# Altium schematic sheet RS232.SchDoc
size A3
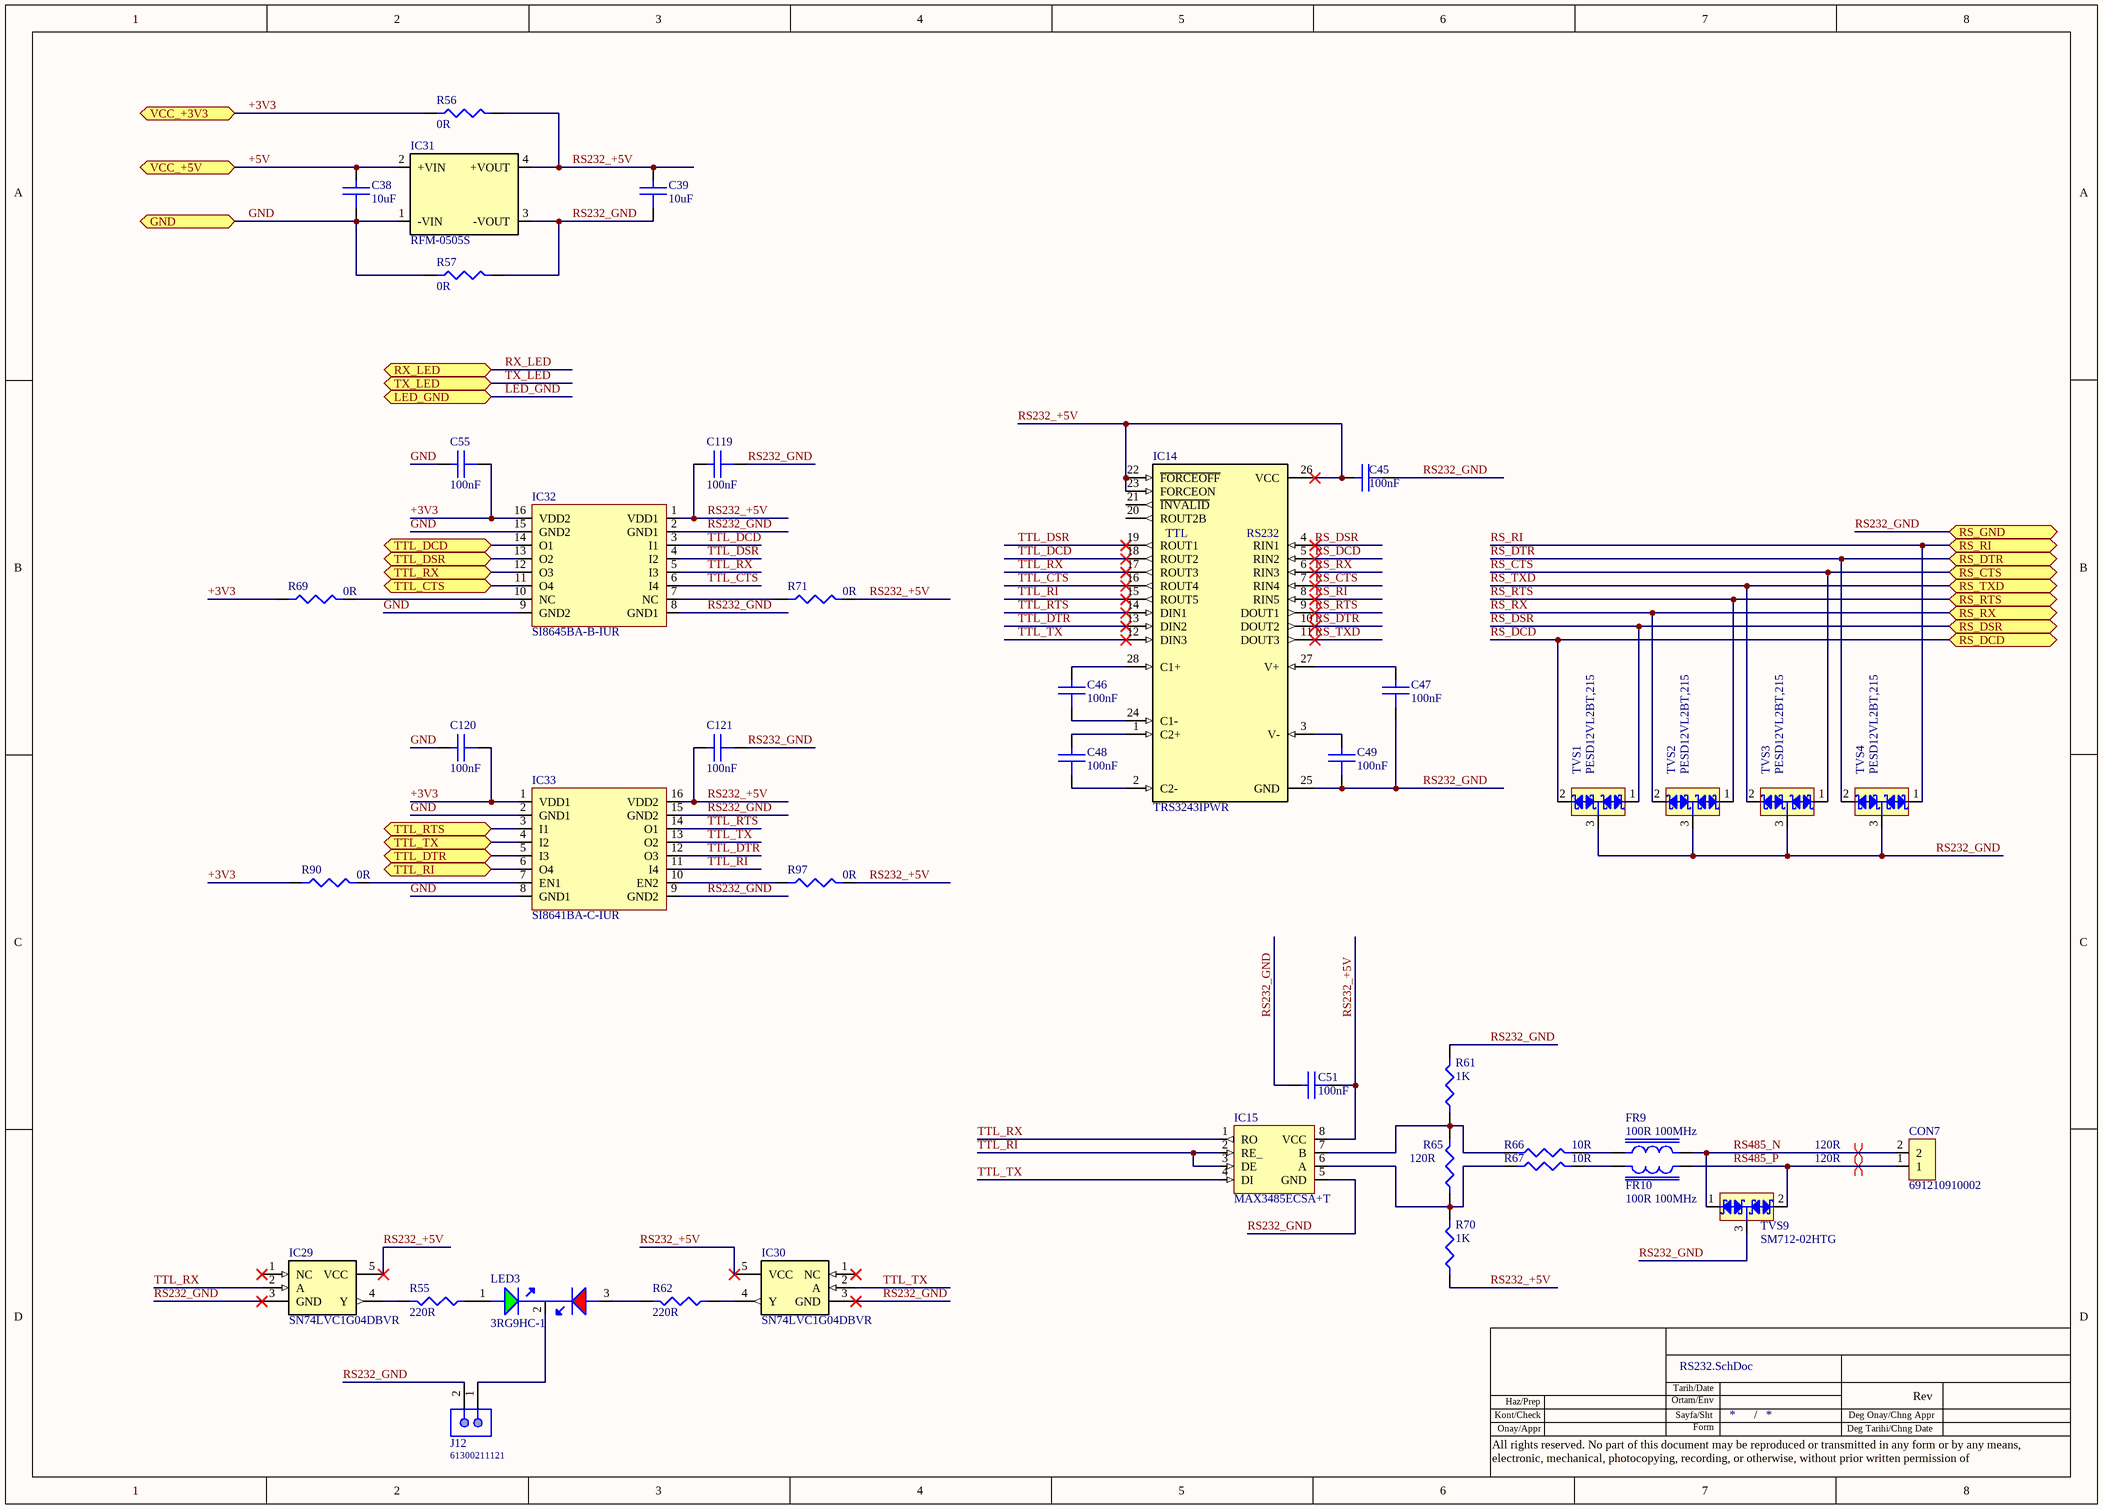
[diagram p0: RS232.SchDoc]

## Parts
C38  10uF  [C0603]
C39  10uF  [C0603]
C45  100nF  [C0603]
C46  100nF  [C0603]
C47  100nF  [C0603]
C48  100nF  [C0603]
C49  100nF  [C0603]
C51  100nF  [C0603]
C55  100nF  [C0603]
C119  100nF  [C0603]
C120  100nF  [C0603]
C121  100nF  [C0603]
CON7  691210910002  [691210910002]
FR9  100R 100MHz  [FR_0603]
FR10  100R 100MHz  [FR_0603]
IC14  TRS3243IPWR  [TSSOP-28]
IC15  MAX3485ECSA+T  [SO08]
IC29  SN74LVC1G04DBVR  [SOT-23-5]
IC30  SN74LVC1G04DBVR  [SOT-23-5]
IC31  RFM-0505S  [RFM-0505S]
IC32  SI8645BA-B-IUR  [QSOP16]
IC33  SI8641BA-C-IUR  [QSOP16]
J12  61300211121  [61300211121]
LED3  3RG9HC-1  [3RG9HC-1]
R55  220R  [R0603]
R56  0R  [R0603]
R57  0R  [R0603]
R61  1K  [R0603]
R62  220R  [R0603]
R65  120R  [R0603]
R66  10R  [R0603]
R67  10R  [R0603]
R69  0R  [R0603]
R70  1K  [R0603]
R71  0R  [R0603]
R90  0R  [R0603]
R97  0R  [R0603]
TVS1  PESD12VL2BT,215  [SOT-23]
TVS2  PESD12VL2BT,215  [SOT-23]
TVS3  PESD12VL2BT,215  [SOT-23]
TVS4  PESD12VL2BT,215  [SOT-23]
TVS9  SM712-02HTG  [SOT-23]

## Ports
GND (bidir), LED_GND (bidir), RS_CTS (bidir), RS_DCD (bidir), RS_DSR (bidir), RS_DTR (bidir), RS_GND (bidir), RS_RI (bidir), RS_RTS (bidir), RS_RX (bidir), RS_TXD (bidir), RX_LED (bidir), TTL_CTS (bidir), TTL_DCD (bidir), TTL_DSR (bidir), TTL_DTR (bidir), TTL_RI (bidir), TTL_RTS (bidir), TTL_RX (bidir), TTL_TX (bidir), TX_LED (bidir), VCC_+3V3 (bidir), VCC_+5V (bidir)

## Nets
+3V3: C55.2 C120.2 IC32.16(VDD2) IC33.1(VDD1) R56.1 R69.1 R90.1 ; port VCC_+3V3
+5V: C38.1 IC31.2(+VIN) ; port VCC_+5V
GND: C38.2 C55.1 C120.1 IC31.1(-VIN) IC32.9(GND2) IC32.15(GND2) IC33.2(GND1) IC33.8(GND1) R57.1 ; port GND
LED_GND: port LED_GND
RS232_+5V: C39.1 C45.1 C51.2 C119.1 C121.1 IC14.22(~{FORCEOFF}) IC14.23(FORCEON) IC14.26(VCC) IC15.8(VCC) IC29.5(VCC) IC30.5(VCC) IC31.4(+VOUT) IC32.1(VDD1) IC33.16(VDD2) R56.2 R70.1 R71.2 R97.2
RS232_GND: C39.2 C45.2 C47.2 C49.2 C51.1 C119.2 C121.2 IC14.25(GND) IC15.5(GND) IC29.3(GND) IC30.3(GND) IC31.3(-VOUT) IC32.2(GND1) IC32.8(GND1) IC33.9(GND2) IC33.15(GND2) J12.2 R57.2 R61.2 TVS1.3 TVS2.3 TVS3.3 TVS4.3 TVS9.3 ; port RS_GND
RS485_N: CON7.2 FR9.2 TVS9.1
RS485_P: CON7.1 FR10.1 TVS9.2
RS_CTS: IC14.7(RIN4) TVS3.1 ; port RS_CTS
RS_DCD: IC14.5(RIN2) TVS1.2 ; port RS_DCD
RS_DSR: IC14.4(RIN1) TVS1.1 ; port RS_DSR
RS_DTR: IC14.10(DOUT2) TVS4.2 ; port RS_DTR
RS_RI: IC14.8(RIN5) TVS4.1 ; port RS_RI
RS_RTS: IC14.9(DOUT1) TVS2.1 ; port RS_RTS
RS_RX: IC14.6(RIN3) TVS2.2 ; port RS_RX
RS_TXD: IC14.11(DOUT3) TVS3.2 ; port RS_TXD
RX_LED: port RX_LED
TTL_CTS: IC14.16(ROUT4) IC32.6(I4)
TTL_CTS: IC32.11(O4) ; port TTL_CTS  [a separate net that carries the same name]
TTL_DCD: IC14.18(ROUT2) IC32.3(I1)
TTL_DCD: IC32.14(O1) ; port TTL_DCD  [a separate net that carries the same name]
TTL_DSR: IC14.19(ROUT1) IC32.4(I2)
TTL_DSR: IC32.13(O2) ; port TTL_DSR  [a separate net that carries the same name]
TTL_DTR: IC14.13(DIN2) IC33.12(O3)
TTL_DTR: IC33.5(I3) ; port TTL_DTR  [a separate net that carries the same name]
TTL_RI: IC14.15(ROUT5) IC15.2(RE_) IC15.3(DE) IC33.11(I4)
TTL_RI: IC33.6(O4) ; port TTL_RI  [a separate net that carries the same name]
TTL_RTS: IC14.14(DIN1) IC33.14(O1)
TTL_RTS: IC33.3(I1) ; port TTL_RTS  [a separate net that carries the same name]
TTL_RX: IC14.17(ROUT3) IC15.1(RO) IC29.2(A) IC32.5(I3)
TTL_RX: IC32.12(O3) ; port TTL_RX  [a separate net that carries the same name]
TTL_TX: IC14.12(DIN3) IC15.4(DI) IC30.2(A) IC33.13(O2)
TTL_TX: IC33.4(I2) ; port TTL_TX  [a separate net that carries the same name]
TX_LED: port TX_LED
NetC46_1: C46.1 IC14.28(C1+)
NetC46_2: C46.2 IC14.24(C1-)
NetC47_1: C47.1 IC14.27(V+)
NetC48_1: C48.1 IC14.1(C2+)
NetC48_2: C48.2 IC14.2(C2-)
NetC49_1: C49.1 IC14.3(V-)
NetFR9_1: FR9.1 R66.2
NetFR10_2: FR10.2 R67.2
NetIC15_6: IC15.6(A) R65.1 R67.1 R70.2
NetIC15_7: IC15.7(B) R61.1 R65.2 R66.1
NetIC29_4: IC29.4(Y) R55.2
NetIC30_4: IC30.4(Y) R62.1
NetIC32_7: IC32.7(NC) R71.1
NetIC32_10: IC32.10(NC) R69.2
NetIC33_7: IC33.7(EN1) R90.2
NetIC33_10: IC33.10(EN2) R97.1
NetJ12_1: J12.1 LED3.2
NetLED3_1: LED3.1 R55.1
NetLED3_3: LED3.3 R62.2

Not connected (* = marked no-connect by the designer): IC14 20(ROUT2B) 21(~{INVALID}); IC29 1(NC)*; IC30 1(NC)*

## Layout directives
differential pair; differential pair class 120R: RS485_N, RS485_P

## Notes on the sheet
- Tarih/Date
- Kont/Check
- Onay/Appr
- Haz/Prep
- Ortam/Env
- Sayfa/Sht
- Form
- /
- Deg Tarihi/Chng Date
- Deg Onay/Chng Appr
- Rev
- All rights reserved. No part of this document may be reproduced or transmitted in any form or by any means, electronic, mechanical, photocopying, recording, or otherwise, without prior written permission of
- (in symbol TRS3243IPWR) TTL; RS232

## Library data of the parts
C38 C39 = CC0603MRX5R6BB106: 10uF 10V X5R 20% SMD 0603 85C Paper T/R; Manufacturer: Yageo; Supplier 1: Digi-Key; Supplier Part Number 1: 311-1817-1-ND; Manufacturer Part Number: CC0603MRX5R6BB106; Stock 1: 209492; Pricing 1: 1 = 0,20000, 10 = 0,13700, 50 = 0,08200, 100 = 0,06920, 500 = 0,04736, 1000 = 0,04190 (USD); RoHS: Yes; Mount: Surface Mount; Case/Package: 0603; Case Code (Imperial): 0603; Case Code (Metric): 1608; Weight: 7.1E-05oz; Min Operating Temperature: -55°C; Max Operating Temperature: 85°C; Voltage Rating: 10V; Termination: SMD/SMT; Resistor Type: Ceramic; Dielectric: X5R; Tolerance: 20%; Packaging: Tape and Reel; Capacitance: 10uF; Voltage Rating (DC): 10V; Length: 0.063inch; Width: 0.031inch; Thickness: 0.035inch; Depth: 0.8mm; Lead Free: Lead Free; Halogen Free: Halogen Free; ComponentLink1URL: http://components.arrow.com/part/dataview/0323_03079270?src-supplier=Arrow+Europe; ComponentLink1Description: http://components.arrow.com/part/dataview/0323_03079270?src-supplier=Arrow+Europe; ComponentLink2URL: http://www.mouser.com/ds/2/447/UPY-GPHC_X5R_4V-to-50V_25-1131599.pdf?src-supplier=Mouser; ComponentLink2Description: http://www.mouser.com/ds/2/447/UPY-GPHC_X5R_4V-to-50V_25-1131599.pdf?src-supplier=Mouser; ComponentLink3URL: http://www.yageo.com/documents/recent/UPY-GPHC_X5R_4V-to-50V_25.pdf?src-supplier=Digi-Key; ComponentLink3Description: http://www.yageo.com/documents/recent/UPY-GPHC_X5R_4V-to-50V_25.pdf?src-supplier=Digi-Key; Category: Capasitor
C45-C49 C51 C55 C119-C121 = CC0603KRX7R8BB104: 100nF, 25V, X7R, 10%, 0603; Manufacturer: Yageo; Supplier 1: Digi-Key; Supplier Part Number 1: 311-1341-1-ND; Manufacturer Part Number: CC0603KRX7R8BB104; Stock 1: 10150433; Pricing 1: 1 = 0,10000, 10 = 0,04500, 50 = 0,02480, 100 = 0,02020, 500 = 0,01444, 1000 = 0,01134 (USD); RoHS: Yes; Mount: Surface Mount; Case/Package: 0603; Number of Pins: 2; Case Code (Imperial): 0603; Case Code (Metric): 1608; Min Operating Temperature: -55°C; Max Operating Temperature: 125°C; Capacitance: 100nF; Tolerance: 10%; Voltage Rating: 25V; Packaging: Tape and Reel; Package Quantity: 1; Voltage Rating (DC): 25V; Dielectric: X7R; Termination: SMD/SMT; Resistor Type: Ceramic; Voltage: 25V; Length: 1.6mm; Width: 0.8mm; Height: 0.8mm; Thickness: 0.035inch; Depth: 0.8mm; Radiation Hardening: No; REACH SVHC: Unknown; Lead Free: Lead Free; Halogen Free: Halogen Free; ComponentLink1URL: https://datasheet.ciiva.com/11786/0900766b80c10176-11786120.pdf?src-supplier=RSComponents; ComponentLink1Description: https://datasheet.ciiva.com/11786/0900766b80c10176-11786120.pdf?src-supplier=RSComponents; ComponentLink2URL: https://datasheet.ciiva.com/144/mlccorderingcode-144075.pdf?src-supplier=Digi-Key; ComponentLink2Description: https://datasheet.ciiva.com/144/mlccorderingcode-144075.pdf?src-supplier=Digi-Key; ComponentLink3URL: https://datasheet.ciiva.com/17434/upy-gphc-x7r-6-3v-to-50v-8-17434263.pdf?src-supplier=Avnet+Europe; ComponentLink3Description: https://datasheet.ciiva.com/17434/upy-gphc-x7r-6-3v-to-50v-8-17434263.pdf?src-supplier=Avnet+Europe; ComponentLink4URL: https://datasheet.ciiva.com/26829/getdatasheetpartid-403577-26829431.pdf?src-supplier=Verical; ComponentLink4Description: https://datasheet.ciiva.com/26829/getdatasheetpartid-403577-26829431.pdf?src-supplier=Verical; ComponentLink5URL: https://datasheet.ciiva.com/11587/upy-gphc-x7r-6-3v-to-50v-8-11587208.pdf?src-supplier=Avnet; ComponentLink5Description: https://datasheet.ciiva.com/11587/upy-gphc-x7r-6-3v-to-50v-8-11587208.pdf?src-supplier=Avnet; ComponentLink6URL: https://datasheet.ciiva.com/13389/upy-gphc-x7r-6-3v-to-50v-8-13389352.pdf?src-supplier=Mouser; ComponentLink6Description: https://datasheet.ciiva.com/13389/upy-gphc-x7r-6-3v-to-50v-8-13389352.pdf?src-supplier=Mouser; ComponentLink7URL: https://datasheet.ciiva.com/28450/1489800-28450584.pdf?src-supplier=Element14; ComponentLink7Description: https://datasheet.ciiva.com/28450/1489800-28450584.pdf?src-supplier=Element14; ComponentLink8URL: https://datasheet.ciiva.com/144/mlccorderingcode-144073.pdf?src-supplier=Digi-Key; ComponentLink8Description: https://datasheet.ciiva.com/144/mlccorderingcode-144073.pdf?src-supplier=Digi-Key; ComponentLink9URL: https://datasheet.ciiva.com/144/mlccorderingcode-144074.pdf?src-supplier=Digi-Key; ComponentLink9Description: https://datasheet.ciiva.com/144/mlccorderingcode-144074.pdf?src-supplier=Digi-Key; ComponentLink10URL: https://datasheet.ciiva.com/7978/1489800-7978155.pdf?src-supplier=Element14; ComponentLink10Description: https://datasheet.ciiva.com/7978/1489800-7978155.pdf?src-supplier=Element14; Category: Capasitor
CON7 = 691210910002: 2.54 Mm Terminal Block, Horizont; Manufacturer: Wurth Electronics; Supplier 1: Digi-Key; Supplier Part Number 1: 732-691210910002-ND; Manufacturer Part Number: 691210910002; Stock 1: 1189; Pricing 1: 1 = 1,10000, 10 = 1,00100, 50 = 0,94400, 100 = 0,86900, 500 = 0,71700 (USD); RoHS: No; Category: Connectors, Interconnects Terminal Blocks - Wire to Board
FR9 FR10 = 742792620: 100Ohm 100MHz 500mA 0603 SMD; Manufacturer: Wurth Electronics; Tolerance: 25%; Resistance: 150mR; Number of Lines: 1; Supplier 1: Digi-Key; Supplier Part Number 1: 732-1579-1-ND; Manufacturer Part Number: 742792620; Stock 1: 4265; Pricing 1: 1 = 0,14000, 50 = 0,14000, 100 = 0,12900, 500 = 0,12300, 1000 = 0,11800, 2000 = 0,11200 (USD); RoHS: Yes; Mount: Surface Mount; Case/Package: SMD/SMT; Number of Pins: 2; Weight: 0.000141oz; Case Code (Metric): 1608; Case Code (Imperial): 0603; Material: Ferrite; Min Operating Temperature: -55°C; Max Operating Temperature: 125°C; Package Quantity: 1; Current Rating: 500mA; Packaging: Tape and Reel; Impedance: 100R; Max Current Rating: 500mA; DC Resistance (DCR): 150mR; Max DC Current: 500mA; Termination: SMD/SMT; Test Frequency: 100MHz; Length: 1.6mm; Width: 0.8mm; Height: 0.8mm; Depth: 0.8mm; REACH SVHC: Unknown; Lead Free: Lead Free; ComponentLink1URL: https://datasheet.ciiva.com/1013/742792620-1013392.pdf?src-supplier=Digi-Key; ComponentLink1Description: https://datasheet.ciiva.com/1013/742792620-1013392.pdf?src-supplier=Digi-Key; ComponentLink2URL: https://datasheet.ciiva.com/30489/0900766b812a674b-30489152.pdf?src-supplier=RSComponents; ComponentLink2Description: https://datasheet.ciiva.com/30489/0900766b812a674b-30489152.pdf?src-supplier=RSComponents; ComponentLink3URL: https://datasheet.ciiva.com/23762/742792620-23762994.pdf?src-supplier=Newark; ComponentLink3Description: https://datasheet.ciiva.com/23762/742792620-23762994.pdf?src-supplier=Newark; ComponentLink4URL: https://datasheet.ciiva.com/22711/530503-22711411.pdf?src-supplier=Element14; ComponentLink4Description: https://datasheet.ciiva.com/22711/530503-22711411.pdf?src-supplier=Element14; ComponentLink5URL: https://datasheet.ciiva.com/4940/742792620-81075-4940413.pdf?src-supplier=Mouser; ComponentLink5Description: https://datasheet.ciiva.com/4940/742792620-81075-4940413.pdf?src-supplier=Mouser; ComponentLink6URL: https://datasheet.ciiva.com/1013/742792620-1013393.pdf?src-supplier=Digi-Key; ComponentLink6Description: https://datasheet.ciiva.com/1013/742792620-1013393.pdf?src-supplier=Digi-Key; ComponentLink7URL: https://datasheet.ciiva.com/1013/742792620-1013394.pdf?src-supplier=Digi-Key; ComponentLink7Description: https://datasheet.ciiva.com/1013/742792620-1013394.pdf?src-supplier=Digi-Key; ComponentLink8URL: https://datasheet.ciiva.com/1466/530503-1466423.pdf?src-supplier=Element14; ComponentLink8Description: https://datasheet.ciiva.com/1466/530503-1466423.pdf?src-supplier=Element14; ComponentLink9URL: https://datasheet.ciiva.com/48698/001087044-da-01-ml-we-cbf-smd-ferrit-742792620-de-en-48698348.pdf?src-supplier=Conrad; ComponentLink9Description: https://datasheet.ciiva.com/48698/001087044-da-01-ml-we-cbf-smd-ferrit-742792620-de-en-48698348.pdf?src-supplier=Conrad; Category: Filters - Ferrite Beads and Chips
IC14 = TRS3243IPWR: 3-V to 5.5-V Multichannel RS-232 Line Driver/Receiver With +/-15-kV (HBM) ESD Protection 28-TSSOP -40 to 85; Manufacturer: Texas Instruments; Data Rate: 250Kbps; Number of Receivers: 5; Number of Transmitters: 3; Max Supply Voltage: 5.5V; Min Supply Voltage: 3V; Nominal Supply Current: 1mA; Number of Transceivers: 1; Operating Supply Voltage: 5V; Supplier 1: Mouser; Supplier Part Number 1: 595-TRS3243IPWR; Manufacturer Part Number: TRS3243IPWR; Stock 1: 2373; Pricing 1: 1 = 1,72000, 10 = 1,46000, 100 = 1,17000, 250 = 1,03000, 500 = 0,99100, 1000 = 0,78700 (USD); Mount: Surface Mount; Case/Package: TSSOP; Number of Pins: 28; Weight: 0.004145oz; Min Operating Temperature: -40°C; Max Operating Temperature: 85°C; Package Quantity: 1; Packaging: Tape and Reel; Number of Drivers: 3; Logic Function: Receiver; Radiation Hardening: No; Lead Free: Lead Free; ComponentLink1URL: https://datasheet.ciiva.com/26913/getdatasheetpartid-247119-26913223.pdf?src-supplier=Verical; ComponentLink1Description: https://datasheet.ciiva.com/26913/getdatasheetpartid-247119-26913223.pdf?src-supplier=Verical; ComponentLink2URL: https://datasheet.ciiva.com/1705/trs3243-1705475.pdf?src-supplier=Digi-Key; ComponentLink2Description: https://datasheet.ciiva.com/1705/trs3243-1705475.pdf?src-supplier=Digi-Key; ComponentLink3URL: https://datasheet.ciiva.com/1705/trs3243-1705476.pdf?src-supplier=Digi-Key; ComponentLink3Description: https://datasheet.ciiva.com/1705/trs3243-1705476.pdf?src-supplier=Digi-Key; ComponentLink4URL: https://datasheet.ciiva.com/1705/trs3243-1705477.pdf?src-supplier=Digi-Key; ComponentLink4Description: https://datasheet.ciiva.com/1705/trs3243-1705477.pdf?src-supplier=Digi-Key; ComponentLink5URL: https://octopart.com/click/track?ai=10049&ct=datasheets&sig=01ed8e4&at=physicalpart&sid=370&ppid=7097462&hlid=30260159&src-supplier=TI+store; ComponentLink5Description: https://octopart.com/click/track?ai=10049&ct=datasheets&sig=01ed8e4&at=physicalpart&sid=370&ppid=7097462&hlid=30260159&src-supplier=TI+store; ComponentLink6URL: http://datasheet.octopart.com/TRS3243IPWR-Texas-Instruments-datasheet-149751.pdf?src-supplier=TI+store; ComponentLink6Description: http://datasheet.octopart.com/TRS3243IPWR-Texas-Instruments-datasheet-149751.pdf?src-supplier=TI+store; ComponentLink7URL: http://datasheet.octopart.com/TRS3243IPWR-Texas-Instruments-datasheet-10256493.pdf?src-supplier=TI+store; ComponentLink7Description: http://datasheet.octopart.com/TRS3243IPWR-Texas-Instruments-datasheet-10256493.pdf?src-supplier=TI+store; ComponentLink8URL: http://datasheet.octopart.com/TRS3243IPWR-Texas-Instruments-datasheet-41218929.pdf?src-supplier=TI+store; ComponentLink8Description: http://datasheet.octopart.com/TRS3243IPWR-Texas-Instruments-datasheet-41218929.pdf?src-supplier=TI+store; ComponentLink9URL: http://sigma.octopart.com/49249796/technical_drawing/Texas-Instruments-TRS3243IPWR.pdf?src-supplier=TI+store; ComponentLink9Description: http://sigma.octopart.com/49249796/technical_drawing/Texas-Instruments-TRS3243IPWR.pdf?src-supplier=TI+store; Category: Integrated Circuits-Interface - Drivers, Receivers, Transceivers
IC15 = MAX3485ECSA+T: IC TXRX RS485/422 10MBPS 8SOIC; Manufacturer: Maxim; Data Rate: 15Mbps; Number of Receivers: 1; Operating Supply Voltage: 3.3V; Nominal Supply Current: 1mA; Max Power Dissipation: 727mW; Output Current: 60mA; Output Voltage: 12.5V; Propagation Delay: 22ns; Logic Function: Transceiver; Interface: RS-422; Min Supply Voltage: 3V; Max Supply Voltage: 3.6V; Simplex/Duplex: Half Duplex; Receiver Hysteresis: 50mV; Supplier 1: Digi-Key; Supplier Part Number 1: MAX3485ECSA+CT-ND; Manufacturer Part Number: MAX3485ECSA+T; RoHS: Yes; Stock 1: 2261; Pricing 1: 1 = 5,74000, 10 = 5,12400, 25 = 4,61200, 100 = 4,20190, 250 = 3,79196, 500 = 3,40250, 1000 = 2,86958 (USD); Mount: Surface Mount; Case/Package: SOIC; Number of Pins: 8; Contact Plating: Tin; Min Operating Temperature: 0°C; Max Operating Temperature: 70°C; Number of Transmitters: 1; Package Quantity: 2500; Packaging: Tape and Reel; Number of Transceivers: 1; Number of Drivers: 1; Length: 5mm; Height: 1.5mm; Width: 4mm; Radiation Hardening: No; REACH SVHC: Unknown; ComponentLink1URL: https://datasheet.ciiva.com/22828/0900766b810e26bd-22828313.pdf?src-supplier=RSComponents; ComponentLink1Description: https://datasheet.ciiva.com/22828/0900766b810e26bd-22828313.pdf?src-supplier=RSComponents; ComponentLink2URL: https://datasheet.ciiva.com/26830/max3485ecsa-t-26830030.pdf?src-supplier=IIIC; ComponentLink2Description: https://datasheet.ciiva.com/26830/max3485ecsa-t-26830030.pdf?src-supplier=IIIC; ComponentLink3URL: https://datasheet.ciiva.com/1774/max3483e-max3491e-1774868.pdf?src-supplier=Digi-Key; ComponentLink3Description: https://datasheet.ciiva.com/1774/max3483e-max3491e-1774868.pdf?src-supplier=Digi-Key; ComponentLink4URL: https://datasheet.ciiva.com/14430/max3483e-max3491e-14430090.pdf?src-supplier=Avnet; ComponentLink4Description: https://datasheet.ciiva.com/14430/max3483e-max3491e-14430090.pdf?src-supplier=Avnet; Category: Integrated Circuits-Interface - Drivers, Receivers, Transceivers
IC29 IC30 = SN74LVC1G04DBVR: Inverter 1-Element CMOS 5-Pin SOT-23 T/R; Manufacturer: Texas Instruments; Number of Inputs: 1; Propagation Delay: 3.7ns; Output Current: 32mA; Min Supply Voltage: 1.65V; Max Supply Voltage: 5.5V; Logic Function: Inverter,Inverting,Buffer; Quiescent Current: 10uA; High Level Output Current: -32mA; Turn-On Delay Time: 7.5ns; Schmitt Trigger Input: No; Supplier 1: Digi-Key; Manufacturer Part Number: SN74LVC1G04DBVR; Stock 1: 132873; Pricing 1: 1 = 0,30000, 10 = 0,24700, 25 = 0,20720, 100 = 0,13110, 250 = 0,10120, 500 = 0,08624, 1000 = 0,05865 (USD); RoHS: Yes; Mount: Surface Mount; Case/Package: SOT-23; Number of Pins: 5; Weight: 0.000557oz; Contact Plating: Tin,Matte; Min Operating Temperature: -40°C; Max Operating Temperature: 125°C; Packaging: Tape and Reel; Max Output Current: 32mA; Number of Elements: 1; Package Quantity: 1; Number of Circuits: 1; Low Level Output Current: 32mA; Termination: SMD/SMT; Number of Gates: 1; Number of Bits: 1; Length: 3.05mm; Width: 1.75mm; Height: 1.3mm; Radiation Hardening: No; REACH SVHC: No SVHC; Lead Free: Lead Free; RoHS Compliant: Yes; ComponentLink1URL: https://datasheet.ciiva.com/1864/sn74lvc1g04-1864160.pdf?src-supplier=Digi-Key; ComponentLink1Description: https://datasheet.ciiva.com/1864/sn74lvc1g04-1864160.pdf?src-supplier=Digi-Key; ComponentLink2URL: https://datasheet.ciiva.com/7783/1700972-7783424.pdf?src-supplier=Element14; ComponentLink2Description: https://datasheet.ciiva.com/7783/1700972-7783424.pdf?src-supplier=Element14; ComponentLink3URL: https://datasheet.ciiva.com/36526/2014932-36526251.pdf?src-supplier=Jameco; ComponentLink3Description: https://datasheet.ciiva.com/36526/2014932-36526251.pdf?src-supplier=Jameco; ComponentLink4URL: https://datasheet.ciiva.com/14290/sn74lvc1g04-14290295.pdf?src-supplier=Avnet; ComponentLink4Description: https://datasheet.ciiva.com/14290/sn74lvc1g04-14290295.pdf?src-supplier=Avnet; ComponentLink5URL: https://datasheet.ciiva.com/1864/sn74lvc1g04-1864158.pdf?src-supplier=Digi-Key; ComponentLink5Description: https://datasheet.ciiva.com/1864/sn74lvc1g04-1864158.pdf?src-supplier=Digi-Key; Category: Integrated Circuits (ICs); Supplier Part Number 1: 296-11599-1-ND
IC31 = RFM-0505S: RECOM POWER - RFM-0505S - Isolated Board Mount DC/DC Converter, ITE & General, 1 Output, 1 W, 5 V, 200 mA; Max Output Voltage: 5V; Supplier 1: Digi-Key; Manufacturer: Recom; Manufacturer Part Number: RFM-0505S; Stock 1: 13682; Pricing 1: 1 = 1,40000, 5 = 1,38000, 10 = 1,36000, 25 = 1,32000, 50 = 1,28000, 100 = 1,24000, 250 = 1,20000, 500 = 1,12000 (USD); RoHS: No; Weight: 1.4g; Length: 11.5mm; Height: 10mm; Width: 6mm; ComponentLink1URL: http://www.farnell.com/datasheets/2787866.pdf?src-supplier=Farnell; ComponentLink1Description: http://www.farnell.com/datasheets/2787866.pdf?src-supplier=Farnell; ComponentLink2URL: https://www.recom-power.com/pdf/Econoline/RFM.pdf?src-supplier=Digi-Key; ComponentLink2Description: https://www.recom-power.com/pdf/Econoline/RFM.pdf?src-supplier=Digi-Key; ComponentLink3URL: http://www.farnell.com/datasheets/2787866.pdf?src-supplier=Newark; ComponentLink3Description: http://www.farnell.com/datasheets/2787866.pdf?src-supplier=Newark; Supplier Part Number 1: 945-3159-ND; Category: Power Supplies - Board Mount DC-DC Converters
IC32 = SI8645BA-B-IUR: Digital Isolator CMOS 4-CH 150Mbps Automotive 16-Pin QSOP T/R; Manufacturer: Silicon Labs; Number of Channels: 4; Propagation Delay: 13ns; Channel Type: Unidirectional; Isolated Power: No; Pulse Width Distortion (PWD): 4.5ns; Supplier 1: Digi-Key; Manufacturer Part Number: SI8645BA-B-IUR; Stock 1: 4650; Pricing 1: 1 = 1,64000, 25 = 1,57480, 100 = 1,55400 (USD); RoHS: Yes; Case/Package: QSOP; Number of Pins: 16; Weight: 0.002931oz; Min Operating Temperature: -40°C; Max Operating Temperature: 125°C; Package Quantity: 2500; Packaging: Tape and Reel; Data Rate: 150Mbps; Type: General Purpose; Series: Si8645BA; RoHS Compliant: Yes; ComponentLink1URL: https://datasheet.ciiva.com/15272/si864x-15272845.pdf?src-supplier=Arrow+Europe; ComponentLink1Description: https://datasheet.ciiva.com/15272/si864x-15272845.pdf?src-supplier=Arrow+Europe; ComponentLink2URL: https://datasheet.ciiva.com/8124/si864x-8124729.pdf?src-supplier=Avnet; ComponentLink2Description: https://datasheet.ciiva.com/8124/si864x-8124729.pdf?src-supplier=Avnet; Supplier Part Number 1: SI8645BA-B-IURCT-ND; Category: Isolators
IC33 = SI8641BA-C-IUR: General Purpose tal Isolator 1000Vrms 4 Channel 150Mbps 35kV/µs CMTI 16-SSOP (0.154 , 3.90mm Width); Manufacturer: Silicon Labs; Number of Channels: 4; Channel Type: Unidirectional; Propagation Delay: 13ns; Isolated Power: No; Pulse Width Distortion (PWD): 4.5ns; Supplier 1: Digi-Key; Manufacturer Part Number: SI8641BA-C-IUR; Stock 1: 611; Pricing 1: 1 = 1,64000, 25 = 1,57480, 100 = 1,55400 (USD); RoHS: Yes; Case/Package: SSOP; Number of Pins: 16; Min Operating Temperature: -40°C; Max Operating Temperature: 125°C; Type: General Purpose; Packaging: Tape and Reel; Data Rate: 150Mbps; ComponentLink1URL: https://datasheet.ciiva.com/48508/si864x-48508591.pdf?src-supplier=Avnet; ComponentLink1Description: https://datasheet.ciiva.com/48508/si864x-48508591.pdf?src-supplier=Avnet; Supplier Part Number 1: 336-4939-1-ND; Category: Isolators
J12 = 61300211121: WR-PHD Pin Header, THT, pitch 2.54mm, Single Row, Vertical, 2pin; Manufacturer: Wurth Electronics; Pin Number: 2; Gender: Male; Rated Current: 3A; Working Voltage: 250VAC; Withstanding Voltage: 500VAC; Contact Resistance: 20mOhm; Voltage Rating: 250V; Connector Type: Male Pin; ComponentLink1Description: Manufacturer; ComponentLink1URL: http://www.we-online.de; ComponentLink2Description: Datasheet; ComponentLink2URL: https://katalog.we-online.de/em/datasheet/6130xx11121.pdf; Part Number: 61300211121; Published Date: June 2019; Publisher: Wurth Elektronik; Pitch: 2.54mm; Operating Temperature: -40 to +105degC; Mounting Technology: THT; Packaging: Bag; Row Number: Single; Orientation: Vertical; Supplier 1: Digi-Key; Manufacturer Part Number: 61300211121; Stock 1: 150487; Pricing 1: 1 = 0,13000, 10 = 0,10600, 25 = 0,08800, 50 = 0,07400, 100 = 0,06700, 1000 = 0,06100 (USD); RoHS: Yes; Mount: Through Hole; Contact Plating: Gold; Housing Material: PBT; Contact Material: Copper Alloy,Copper; Color: Black; Min Operating Temperature: -40°C; Max Operating Temperature: 125°C; Number of Rows: 1; Contact Gender: Male; Current Rating: 3A; Number of Positions: 2; Termination: Through Hole; Number of Contacts: 2; Contact Mating Length: 0.236inch; REACH SVHC: Unknown; Lead Free: Lead Free; ComponentLink3URL: https://datasheet.ciiva.com/13619/6130xx11121-48870-13619345.pdf?src-supplier=Mouser; ComponentLink3Description: https://datasheet.ciiva.com/13619/6130xx11121-48870-13619345.pdf?src-supplier=Mouser; Category: Connectors, Interconnects Rectangular Connectors; Supplier Part Number 1: 732-5315-ND
LED3 = 3RG9HC-1: LED 3MM RED, GREEN R:30mcd, G:60mcd 40°; Manufacturer: STRONG BASE; Category: Led; Supplier 1: Özdisan; Supplier Part Number 1: 3RG9HC-1
R55 R62 = RC0603FR-07220RL: 220 R, %1, 1/10W, 0603; Manufacturer: Yageo; Tolerance: 1%; Voltage Rating (DC): 50V; Temperature Coefficient: 100ppm/°C; Power Rating: 100mW; Supplier 1: Digi-Key; Supplier Part Number 1: 311-220HRCT-ND; Manufacturer Part Number: RC0603FR-07220RL; Stock 1: 3174401; Pricing 1: 1 = 0,10000, 10 = 0,02100, 100 = 0,00840, 1000 = 0,00379, 2500 = 0,00329 (USD); RoHS: Yes; Case/Package: 0603; Number of Pins: 2; Case Code (Imperial): 0603; Case Code (Metric): 1608; Min Operating Temperature: -55°C; Max Operating Temperature: 155°C; Resistance: 220R; Packaging: Tape and Reel; Resistor Type: Thick Film; Voltage Rating: 50V; Package Quantity: 1; Termination: SMD/SMT; Number of Terminations: 2; Max Power Dissipation: 100mW; Features: Moisture Resistant; Length: 1.6mm; Width: 0.031inch; Height: 0.022inch; Depth: 0.8mm; REACH SVHC: No SVHC; Lead Free: Lead Free; Military Standard: Not; ComponentLink1URL: https://datasheet.ciiva.com/2453/pyu-r-int-thick-7-2453973.pdf?src-supplier=Digi-Key; ComponentLink1Description: https://datasheet.ciiva.com/2453/pyu-r-int-thick-7-2453973.pdf?src-supplier=Digi-Key; ComponentLink2URL: https://datasheet.ciiva.com/2453/pyu-r-int-thick-7-2453974.pdf?src-supplier=Digi-Key; ComponentLink2Description: https://datasheet.ciiva.com/2453/pyu-r-int-thick-7-2453974.pdf?src-supplier=Digi-Key; ComponentLink3URL: https://datasheet.ciiva.com/2453/pyu-r-int-thick-7-2453975.pdf?src-supplier=Digi-Key; ComponentLink3Description: https://datasheet.ciiva.com/2453/pyu-r-int-thick-7-2453975.pdf?src-supplier=Digi-Key; ComponentLink4URL: https://datasheet.ciiva.com/7746/1738695-7746300.pdf?src-supplier=Element14; ComponentLink4Description: https://datasheet.ciiva.com/7746/1738695-7746300.pdf?src-supplier=Element14; ComponentLink5URL: https://datasheet.ciiva.com/7746/1738695-7746301.pdf?src-supplier=Element14; ComponentLink5Description: https://datasheet.ciiva.com/7746/1738695-7746301.pdf?src-supplier=Element14; Category: Resistor
R56 R57 R69 R71 R90 R97 = RC0603FR-070RL: 0R ,%1 ,1/10 W ,0603; Manufacturer: Yageo; Resistance: 0mR; Power Rating: 100mW; Tolerance: 1%; Voltage Rating: 50V; Temperature Coefficient: 200ppm/°C; Current Rating: 1A; Working Voltage: 75V; Supplier 1: Digi-Key; Supplier Part Number 1: 311-0.0HRCT-ND; Manufacturer Part Number: RC0603FR-070RL; Stock 1: 513794; Pricing 1: 1 = 0,10000, 10 = 0,01800, 25 = 0,01280, 50 = 0,00980, 100 = 0,00730, 250 = 0,00552, 500 = 0,00442, 1000 = 0,00326 (USD); RoHS: Yes; Case/Package: 0603; Number of Pins: 2; Case Code (Metric): 1608; Case Code (Imperial): 0603; Contact Plating: Tin,Matte; Min Operating Temperature: -55°C; Max Operating Temperature: 155°C; Packaging: Tape and Reel; Package Quantity: 5000; Resistor Type: Thick Film; Number of Terminations: 2; Termination: SMD/SMT; Max Power Dissipation: 100mW; Voltage Rating (DC): 50V; Features: Moisture Resistant; Length: 1.6mm; Width: 0.031inch; Height: 0.45mm; Depth: 0.8mm; Radiation Hardening: No; REACH SVHC: No SVHC; Military Standard: Not; Lead Free: Lead Free; ComponentLink1URL: https://datasheet.ciiva.com/11808/0900766b80f96399-11808172.pdf?src-supplier=RSComponents; ComponentLink1Description: https://datasheet.ciiva.com/11808/0900766b80f96399-11808172.pdf?src-supplier=RSComponents; ComponentLink2URL: https://datasheet.ciiva.com/5558/rc0603-272842-5558341.pdf?src-supplier=Mouser; ComponentLink2Description: https://datasheet.ciiva.com/5558/rc0603-272842-5558341.pdf?src-supplier=Mouser; ComponentLink3URL: https://datasheet.ciiva.com/46382/443971-46382072.pdf?src-supplier=Element14; ComponentLink3Description: https://datasheet.ciiva.com/46382/443971-46382072.pdf?src-supplier=Element14; ComponentLink4URL: https://datasheet.ciiva.com/29721/pyu-r-int-thick-7-29721178.pdf?src-supplier=Digi-Key; ComponentLink4Description: https://datasheet.ciiva.com/29721/pyu-r-int-thick-7-29721178.pdf?src-supplier=Digi-Key; ComponentLink5URL: https://datasheet.ciiva.com/5684/443971-5684699.pdf?src-supplier=Farnell; ComponentLink5Description: https://datasheet.ciiva.com/5684/443971-5684699.pdf?src-supplier=Farnell; ComponentLink6URL: https://datasheet.ciiva.com/7983/443971-7983627.pdf?src-supplier=Element14; ComponentLink6Description: https://datasheet.ciiva.com/7983/443971-7983627.pdf?src-supplier=Element14; ComponentLink7URL: https://datasheet.ciiva.com/29721/pyu-rc0603-51-rohs-l-4-29721179.pdf?src-supplier=Digi-Key; ComponentLink7Description: https://datasheet.ciiva.com/29721/pyu-rc0603-51-rohs-l-4-29721179.pdf?src-supplier=Digi-Key; ComponentLink8URL: https://datasheet.ciiva.com/22643/1868787-22643388.pdf?src-supplier=Element14; ComponentLink8Description: https://datasheet.ciiva.com/22643/1868787-22643388.pdf?src-supplier=Element14; Category: Resistor
R61 R70 = RC0603FR-071KL: 1K OHM 1% 1/10W 0603; Manufacturer: Yageo; Resistance: 1kR; Temperature Coefficient: 100ppm/°C; Power Rating: 100mW; Voltage Rating: 50V; Supplier 1: Digi-Key; Supplier Part Number 1: 311-1.00KHRCT-ND; Manufacturer Part Number: RC0603FR-071KL; Stock 1: 29851447; Pricing 1: 1 = 0,10000, 10 = 0,02100, 100 = 0,00840, 1000 = 0,00379, 2500 = 0,00329 (USD); RoHS: Yes; Case/Package: 0603; Contact Plating: Tin,Matte; Case Code (Imperial): 0603; Case Code (Metric): 1608; Min Operating Temperature: -55°C; Max Operating Temperature: 155°C; Tolerance: 1%; Packaging: Tape and Reel; Resistor Type: Thick Film; Termination: SMD/SMT; Length: 1.6mm; Height: 0.45mm; Depth: 0.8mm; Radiation Hardening: No; REACH SVHC: No SVHC; Lead Free: Lead Free; Military Standard: Not; ComponentLink1URL: https://datasheet.ciiva.com/11808/0900766b80f96399-11808081.pdf?src-supplier=RSComponents; ComponentLink1Description: https://datasheet.ciiva.com/11808/0900766b80f96399-11808081.pdf?src-supplier=RSComponents; ComponentLink2URL: https://datasheet.ciiva.com/25906/pyu-rc0603-51-rohs-l-4-25906933.pdf?src-supplier=Avnet+Europe; ComponentLink2Description: https://datasheet.ciiva.com/25906/pyu-rc0603-51-rohs-l-4-25906933.pdf?src-supplier=Avnet+Europe; ComponentLink3URL: https://datasheet.ciiva.com/7660/1868787-7660790.pdf?src-supplier=Element14; ComponentLink3Description: https://datasheet.ciiva.com/7660/1868787-7660790.pdf?src-supplier=Element14; ComponentLink4URL: https://datasheet.ciiva.com/7746/1738695-7746279.pdf?src-supplier=Element14; ComponentLink4Description: https://datasheet.ciiva.com/7746/1738695-7746279.pdf?src-supplier=Element14; ComponentLink5URL: https://datasheet.ciiva.com/7746/1686128-7746280.pdf?src-supplier=Element14; ComponentLink5Description: https://datasheet.ciiva.com/7746/1686128-7746280.pdf?src-supplier=Element14; ComponentLink6URL: https://datasheet.ciiva.com/28386/pyu-rc0603-51-rohs-l-4-28386648.pdf?src-supplier=Avnet+Europe; ComponentLink6Description: https://datasheet.ciiva.com/28386/pyu-rc0603-51-rohs-l-4-28386648.pdf?src-supplier=Avnet+Europe; ComponentLink7URL: https://datasheet.ciiva.com/7746/1738695-7746281.pdf?src-supplier=Element14; ComponentLink7Description: https://datasheet.ciiva.com/7746/1738695-7746281.pdf?src-supplier=Element14; ComponentLink8URL: https://datasheet.ciiva.com/8896/pyu-rc0603-51-rohs-l-4-8896106.pdf?src-supplier=Avnet; ComponentLink8Description: https://datasheet.ciiva.com/8896/pyu-rc0603-51-rohs-l-4-8896106.pdf?src-supplier=Avnet; ComponentLink9URL: https://datasheet.ciiva.com/15189/getdatasheetpartid-404327-15189644.pdf?src-supplier=Verical; ComponentLink9Description: https://datasheet.ciiva.com/15189/getdatasheetpartid-404327-15189644.pdf?src-supplier=Verical; ComponentLink10URL: https://datasheet.ciiva.com/7983/443971-7983613.pdf?src-supplier=Element14; ComponentLink10Description: https://datasheet.ciiva.com/7983/443971-7983613.pdf?src-supplier=Element14; Category: Resistor
R65 = RC0603FR-07120RL: 120 Ohm 1% 1/10W 0603; Manufacturer: Yageo; Voltage Rating (DC): 50V; Temperature Coefficient: 100ppm/°C; Power Rating: 100mW; Supplier 1: Digi-Key; Supplier Part Number 1: 311-120HRCT-ND; Manufacturer Part Number: RC0603FR-07120RL; Stock 1: 989111; Pricing 1: 1 = 0,10000, 10 = 0,02100, 100 = 0,00840, 1000 = 0,00379, 2500 = 0,00329 (USD); RoHS: Yes; Case/Package: 0603; Number of Pins: 2; Case Code (Metric): 1608; Case Code (Imperial): 0603; Min Operating Temperature: -55°C; Max Operating Temperature: 155°C; Resistance: 120R; Tolerance: 1%; Packaging: Tape and Reel; Resistor Type: Thick Film; Voltage Rating: 50V; Package Quantity: 1; Number of Terminations: 2; Termination: SMD/SMT; Max Power Dissipation: 100mW; Features: Moisture Resistant; Length: 1.6mm; Width: 0.031inch; Height: 0.022inch; Depth: 0.8mm; REACH SVHC: No SVHC; Lead Free: Lead Free; Military Standard: Not; ComponentLink1URL: https://datasheet.ciiva.com/2553/pyu-r-int-thick-7-2553512.pdf?src-supplier=Digi-Key; ComponentLink1Description: https://datasheet.ciiva.com/2553/pyu-r-int-thick-7-2553512.pdf?src-supplier=Digi-Key; ComponentLink2URL: https://datasheet.ciiva.com/7746/443971-7746248.pdf?src-supplier=Element14; ComponentLink2Description: https://datasheet.ciiva.com/7746/443971-7746248.pdf?src-supplier=Element14; ComponentLink3URL: https://datasheet.ciiva.com/2553/pyu-r-int-thick-7-2553513.pdf?src-supplier=Digi-Key; ComponentLink3Description: https://datasheet.ciiva.com/2553/pyu-r-int-thick-7-2553513.pdf?src-supplier=Digi-Key; ComponentLink4URL: https://datasheet.ciiva.com/7746/443971-7746249.pdf?src-supplier=Element14; ComponentLink4Description: https://datasheet.ciiva.com/7746/443971-7746249.pdf?src-supplier=Element14; ComponentLink5URL: https://datasheet.ciiva.com/2553/pyu-r-int-thick-7-2553514.pdf?src-supplier=Digi-Key; ComponentLink5Description: https://datasheet.ciiva.com/2553/pyu-r-int-thick-7-2553514.pdf?src-supplier=Digi-Key; ComponentLink6URL: https://datasheet.ciiva.com/46395/443971-46395021.pdf?src-supplier=Element14; ComponentLink6Description: https://datasheet.ciiva.com/46395/443971-46395021.pdf?src-supplier=Element14; Category: Resistor
R66 R67 = RC0603FR-0710RL: 10R, 1%, 1/10W, 0603; Manufacturer: Yageo; Voltage Rating (DC): 50V; Temperature Coefficient: 200ppm/°C; Power Rating: 100mW; Supplier 1: Digi-Key; Supplier Part Number 1: 311-10.0HRCT-ND; Manufacturer Part Number: RC0603FR-0710RL; Stock 1: 7663236; Pricing 1: 1 = 0,10000, 10 = 0,04100, 100 = 0,01690, 1000 = 0,00758, 2500 = 0,00658 (USD); RoHS: Yes; Case/Package: 0603; Number of Pins: 2; Case Code (Imperial): 0603; Case Code (Metric): 1608; Contact Plating: Tin,Matte; Min Operating Temperature: -55°C; Max Operating Temperature: 155°C; Packaging: Tape and Reel; Resistance: 10R; Tolerance: 1%; Resistor Type: Thick Film; Voltage Rating: 50V; Termination: SMD/SMT; Length: 1.6mm; Width: 0.8mm; Height: 0.45mm; Depth: 0.8mm; Radiation Hardening: No; REACH SVHC: No SVHC; Lead Free: Lead Free; Military Standard: Not; ComponentLink1URL: https://datasheet.ciiva.com/11808/0900766b80f96399-11808140.pdf?src-supplier=RSComponents; ComponentLink1Description: https://datasheet.ciiva.com/11808/0900766b80f96399-11808140.pdf?src-supplier=RSComponents; ComponentLink2URL: https://datasheet.ciiva.com/7746/443971-7746245.pdf?src-supplier=Element14; ComponentLink2Description: https://datasheet.ciiva.com/7746/443971-7746245.pdf?src-supplier=Element14; ComponentLink3URL: https://datasheet.ciiva.com/8891/pyu-rc0603-51-rohs-l-4-8891285.pdf?src-supplier=Avnet; ComponentLink3Description: https://datasheet.ciiva.com/8891/pyu-rc0603-51-rohs-l-4-8891285.pdf?src-supplier=Avnet; ComponentLink4URL: https://datasheet.ciiva.com/28386/pyu-rc0603-51-rohs-l-4-28386637.pdf?src-supplier=Avnet+Europe; ComponentLink4Description: https://datasheet.ciiva.com/28386/pyu-rc0603-51-rohs-l-4-28386637.pdf?src-supplier=Avnet+Europe; Category: Resistor
TVS1-TVS4 = PESD12VL2BT,215: TVS DIODE 12V 37V SOT23; Manufacturer: Nexperia; Supplier 1: Digi-Key; Manufacturer Part Number: PESD12VL2BT,215; Stock 1: 13763; Pricing 1: 1 = 0,44000, 10 = 0,35700, 100 = 0,24320, 500 = 0,18240, 1000 = 0,13680 (USD); RoHS: Yes; RoHS Compliant: Yes; ComponentLink1URL: http://www.farnell.com/datasheets/698115.pdf?src-supplier=Farnell; ComponentLink1Description: http://www.farnell.com/datasheets/698115.pdf?src-supplier=Farnell; ComponentLink2URL: https://assets.nexperia.com/documents/data-sheet/PESDXL2BT_SER.pdf?src-supplier=Digi-Key; ComponentLink2Description: https://assets.nexperia.com/documents/data-sheet/PESDXL2BT_SER.pdf?src-supplier=Digi-Key; ComponentLink3URL: http://www.farnell.com/datasheets/698115.pdf?src-supplier=Newark; ComponentLink3Description: http://www.farnell.com/datasheets/698115.pdf?src-supplier=Newark; Supplier Part Number 1: 1727-3809-1-ND; Category: Circuit Protection - TVS - Diodes
TVS9 = SM712-02HTG: ESD Suppressor TVS 12V Automotive 3-Pin SOT-23 T/R; Manufacturer: Littelfuse; Number of Bidirectional Channels: 2; Min Breakdown Voltage: 13.3V; Clamping Voltage: 31V; Peak Pulse Power: 600W; Power Line Protection: No; Direction: Bidirectional; Leakage Current: 20uA; Capacitance: 75pF; Element Configuration: Dual; Max Surge Current: 19A; Supplier 1: Digi-Key; Supplier Part Number 1: F6450CT-ND; Manufacturer Part Number: SM712-02HTG; RoHS: Yes; Stock 1: 55460; Pricing 1: 1 = 0,82000, 10 = 0,72100, 25 = 0,63880, 100 = 0,55620, 250 = 0,48412, 500 = 0,41200, 1000 = 0,32960 (USD); Mount: Surface Mount; Case/Package: SOT-23-3; Number of Pins: 3; Min Operating Temperature: -40°C; Max Operating Temperature: 125°C; Packaging: Tape and Reel; Reverse Standoff Voltage: 12V; Working Voltage: 12V; Polarity: Bidirectional; Termination: SMD/SMT; Number of Channels: 2; Breakdown Voltage: 13.3V; Max Power Dissipation: 600W; Package Quantity: 3000; Peak Pulse Current: 19A; Composition: Zener; Length: 3.04mm; Depth: 1.4mm; Radiation Hardening: No; Lead Free: Lead Free; ComponentLink1URL: http://www.farnell.com/datasheets/2277128.pdf?src-supplier=Farnell; ComponentLink1Description: http://www.farnell.com/datasheets/2277128.pdf?src-supplier=Farnell; ComponentLink2URL: http://components.arrow.com/part/dataview/66888491S1073949N9157?src-supplier=Arrow; ComponentLink2Description: http://components.arrow.com/part/dataview/66888491S1073949N9157?src-supplier=Arrow; ComponentLink3URL: http://www.mouser.com/ds/2/240/Littelfuse_TVS_Diode_Array_SM712_Datasheet.pdf-345740.pdf?src-supplier=Mouser; ComponentLink3Description: http://www.mouser.com/ds/2/240/Littelfuse_TVS_Diode_Array_SM712_Datasheet.pdf-345740.pdf?src-supplier=Mouser; ComponentLink4URL: http://www.farnell.com/datasheets/2277128.pdf?src-supplier=Newark; ComponentLink4Description: http://www.farnell.com/datasheets/2277128.pdf?src-supplier=Newark; ComponentLink5URL: http://www.littelfuse.com/~/media/electronics/datasheets/tvs_diode_arrays/littelfuse_tvs_diode_array_sm712_datasheet.pdf.pdf?src-supplier=Digi-Key; ComponentLink5Description: http://www.littelfuse.com/~/media/electronics/datasheets/tvs_diode_arrays/littelfuse_tvs_diode_array_sm712_datasheet.pdf.pdf?src-supplier=Digi-Key; ComponentLink6URL: https://www.littelfuse.com/~/media/electronics/datasheets/tvs_diode_arrays/littelfuse_tvs_diode_array_sm712_datasheet.pdf.pdf?src-supplier=Digi-Key; ComponentLink6Description: https://www.littelfuse.com/~/media/electronics/datasheets/tvs_diode_arrays/littelfuse_tvs_diode_array_sm712_datasheet.pdf.pdf?src-supplier=Digi-Key; Category: Circuit Protection - TVS - Diodes